# Altium schematic sheet DCDC_2_Rev2.SchDoc
size C
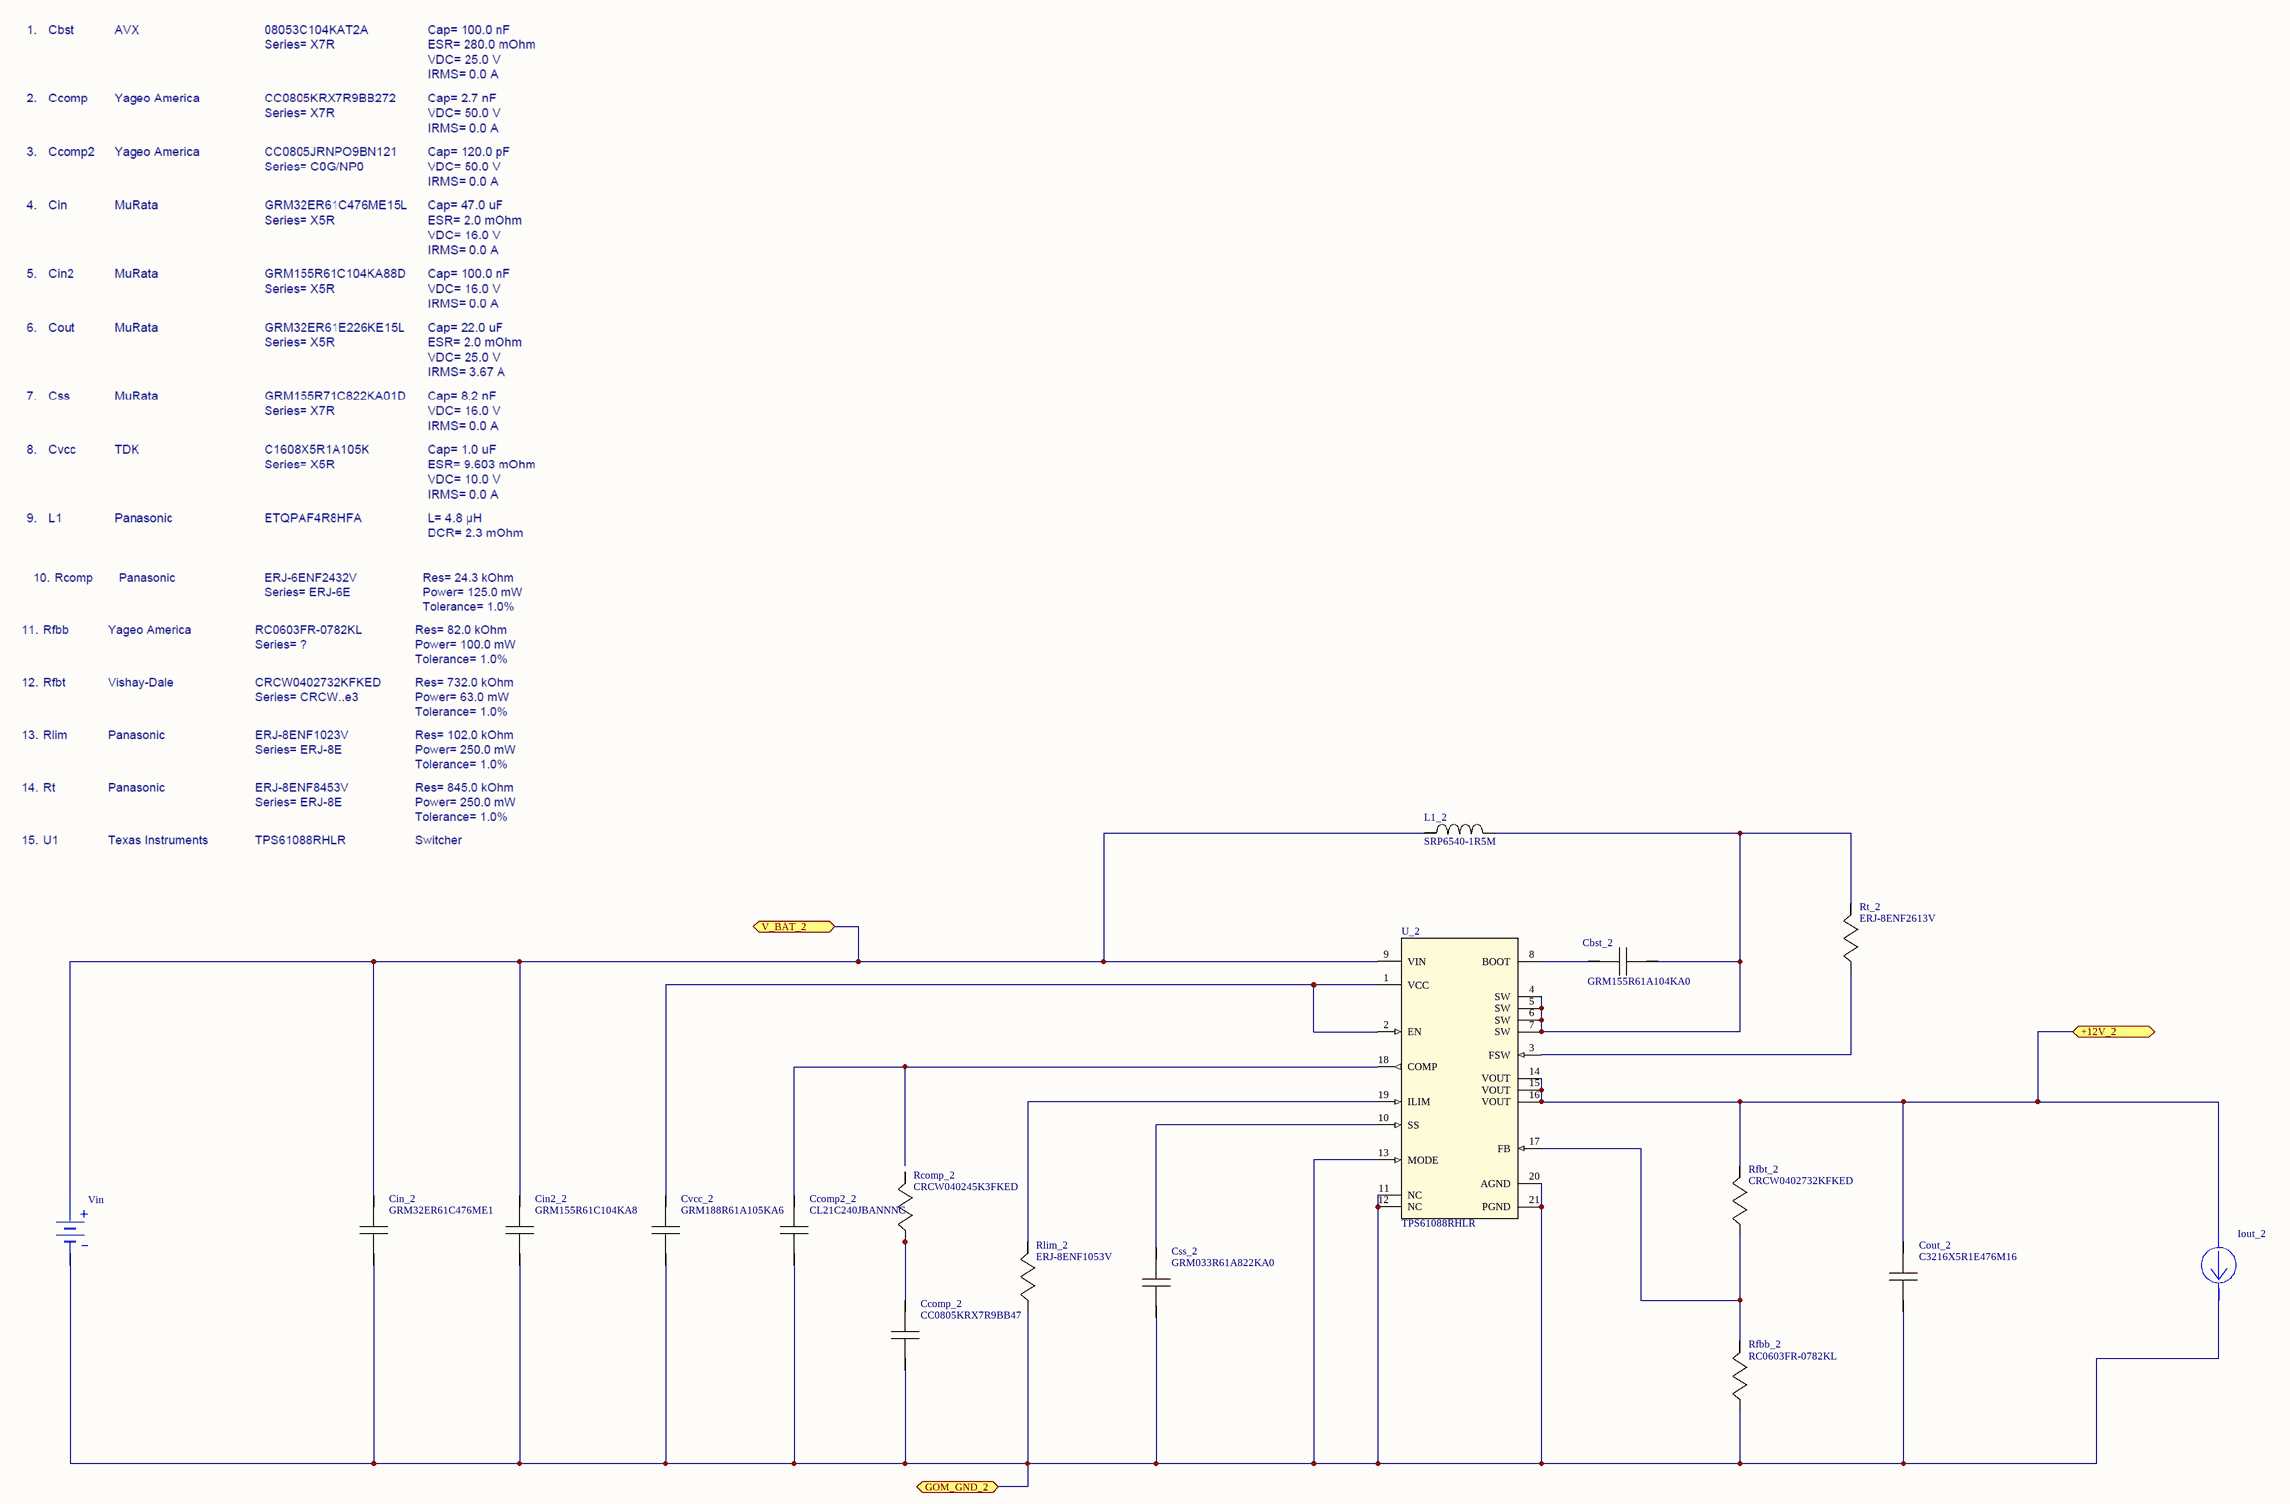
[diagram p0: DCDC_2_Rev2.SchDoc]

## Parts
Cbst_2  GRM155R61A104KA0  [0402]
Ccomp2_2  CL21C240JBANNNC  [0805]
Ccomp_2  CC0805KRX7R9BB47  [0805]
Cin2_2  GRM155R61C104KA8  [0402]
Cin_2  GRM32ER61C476ME1  [1210_280]
Cout_2  C3216X5R1E476M16  [1206_190]
Css_2  GRM033R61A822KA0  [0201]
Cvcc_2  GRM188R61A105KA6  [0603]
Iout_2  WB_CURRENT_LOAD  (value not drawn)
L1_2  SRP6540-1R5M  [SRP6540]
Rcomp_2  CRCW040245K3FKED  [0402]
Rfbb_2  RC0603FR-0782KL  [0603]
Rfbt_2  CRCW0402732KFKED  [0402]
Rlim_2  ERJ-8ENF1053V  [1206]
Rt_2  ERJ-8ENF2613V  [1206]
U_2  TPS61088RHLR  [RHL0020A]
Vin  WB_BATTERY  (value not drawn)

## Ports
+12V_2 (bidir), GOM_GND_2 (bidir), V_BAT_2 (bidir)

## Nets
+12V_2: Cout_2.1 Iout_2.1(+) Rfbt_2.1 U_2.14(VOUT) U_2.15(VOUT) U_2.16(VOUT) ; port +12V_2
GOM_GND_2: Ccomp2_2.2 Ccomp_2.2 Cin2_2.2 Cin_2.2 Cout_2.2 Css_2.2 Cvcc_2.2 Iout_2.2(-) Rfbb_2.2 Rlim_2.2 U_2.11(NC) U_2.12(NC) U_2.13(MODE) U_2.20(AGND) U_2.21(PGND) Vin.2(-) ; port GOM_GND_2
V_BAT_2: Cin2_2.1 Cin_2.1 L1_2.1 U_2.9(VIN) Vin.1(+) ; port V_BAT_2
NetCbst_2_1: Cbst_2.1 L1_2.2 Rt_2.1 U_2.4(SW) U_2.5(SW) U_2.6(SW) U_2.7(SW)
NetCbst_2_2: Cbst_2.2 U_2.8(BOOT)
NetCcomp2_2_1: Ccomp2_2.1 U_2.18(COMP)
NetCcomp_2_1: Ccomp_2.1 Rcomp_2.2
NetCss_2_1: Css_2.1 U_2.10(SS)
NetCvcc_2_1: Cvcc_2.1 U_2.1(VCC) U_2.2(EN)
NetRfbb_2_1: Rfbb_2.1 Rfbt_2.2 U_2.17(FB)
NetRlim_2_1: Rlim_2.1 U_2.19(ILIM)
NetRt_2_2: Rt_2.2 U_2.3(FSW)

Not connected (* = marked no-connect by the designer): Rcomp_2 1

## Library data of the parts
Cbst_2 = GRM155R61A104KA0: Imported; Manufacturer_Part_Number: GRM155R61A104KA01D; Vendor: MuRata; Value: 100nF; Manufacturer_Name: MuRata; RefDes: RefDes; TYPE: TYPE
Ccomp2_2 = CL21C240JBANNNC: Imported; Vendor: Samsung Electro-Mechanics; Value: 24pF; Manufacturer_Part_Number: CL21C240JBANNNC; Manufacturer_Name: Samsung Electro-Mechanics; RefDes: RefDes; TYPE: TYPE
Ccomp_2 = CC0805KRX7R9BB47: Imported; Manufacturer_Part_Number: CC0805KRX7R9BB471; Vendor: Yageo America; Value: 470pF; Manufacturer_Name: Yageo America; RefDes: RefDes; TYPE: TYPE
Cin2_2 = GRM155R61C104KA8: Imported; Manufacturer_Part_Number: GRM155R61C104KA88D; Vendor: MuRata; Value: 100nF; Manufacturer_Name: MuRata; RefDes: RefDes; TYPE: TYPE
Cin_2 = GRM32ER61C476ME1: Imported; Manufacturer_Part_Number: GRM32ER61C476ME15L; Vendor: MuRata; Value: 47uF; Manufacturer_Name: MuRata; RefDes: RefDes; TYPE: TYPE
Cout_2 = C3216X5R1E476M16: Imported; Manufacturer_Part_Number: C3216X5R1E476M160AC; Manufacturer_Name: TDK; Cap_F: 0.000047; VDC_V: 25; RoHS: Y; MountType: SMT; RefDes: RefDes; TYPE: TYPE; Value: Value
Css_2 = GRM033R61A822KA0: Imported; Manufacturer_Part_Number: GRM033R61A822KA01D; Vendor: MuRata; Value: 8.2nF; Manufacturer_Name: MuRata; RefDes: RefDes; TYPE: TYPE
Cvcc_2 = GRM188R61A105KA6: Imported; Manufacturer_Part_Number: GRM188R61A105KA61D; Vendor: MuRata; Value: 1uF; Manufacturer_Name: MuRata; RefDes: RefDes; TYPE: TYPE
Iout_2 = WB_CURRENT_LOAD: Value: UNLISTED; PackageReference: WB_CURRENT_LOAD; Manufacturer Part Number: WB_CURRENT_LOAD; Manufacturer Name: WB_CURRENT_LOAD
L1_2 = SRP6540-1R5M: Imported; Vendor: Bourns; Value: 1.5uH; Manufacturer_Part_Number: SRP6540-1R5M; PACKAGE_DESIGNATOR: SRP6540; Manufacturer: Bourns; Manufacturer_Name: Bourns; RefDes: RefDes; TYPE: TYPE
Rcomp_2 = CRCW040245K3FKED: Imported; Vendor: Vishay-Dale; Value: 45.3k; Manufacturer_Part_Number: CRCW040245K3FKED; Manufacturer_Name: Vishay-Dale; RefDes: RefDes; TYPE: TYPE
Rfbb_2 = RC0603FR-0782KL: Imported; Vendor: Yageo America; Value: 82k; Manufacturer_Part_Number: RC0603FR-0782KL; Manufacturer_Name: Yageo America; RefDes: RefDes; TYPE: TYPE
Rfbt_2 = CRCW0402732KFKED: Imported; Vendor: Vishay-Dale; Value: 732k; Manufacturer_Part_Number: CRCW0402732KFKED; Manufacturer_Name: Vishay-Dale; RefDes: RefDes; TYPE: TYPE
Rlim_2 = ERJ-8ENF1053V: Imported; Vendor: Panasonic; Value: 105k; Manufacturer_Part_Number: ERJ-8ENF1053V; Manufacturer_Name: Panasonic; RefDes: RefDes; TYPE: TYPE
Rt_2 = ERJ-8ENF2613V: Imported; Vendor: Panasonic; Value: 261k; Manufacturer_Part_Number: ERJ-8ENF2613V; Manufacturer_Name: Panasonic; RefDes: RefDes; TYPE: TYPE
U_2 = TPS61088RHLR: Imported; Alternate PartNumber: TPS61088RHLT; Manufacturer: Texas Instruments; CompType: IC; PIN_COUNT: 21; Application_BuildNumber: *; PartNumber: TPS61088RHLR; PackageReference: RHL0020A; MountType: SMT; RoHS: Y; RefDes: RefDes; TYPE: TYPE; Value: Value; Manufacturer_Part_Number: TPS61088RHLR; Manufacturer_Name: Texas Instruments
Vin = WB_BATTERY: Value: UNLISTED; PackageReference: WB_BATTERY; Manufacturer Part Number: WB_BATTERY; Manufacturer Name: WB_BATTERY